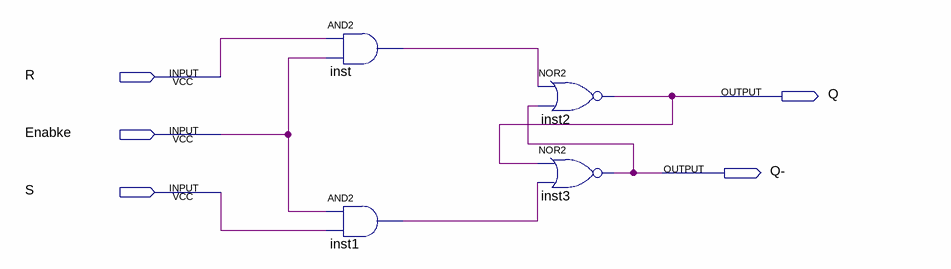
[diagram p0: schematic sheet]
// Quartus schematic Tflip.bdf as structural Verilog: 4 symbols, 5 pins
module Tflip (
  input  R,
  input  Enabke,
  input  S,
  output Q,
  output \Q- 
);

  wire inst1_out, inst_out;

  and inst (inst_out, R, Enabke);
  and inst1 (inst1_out, Enabke, S);
  nor inst2 (Q, inst_out, \Q- );
  nor inst3 (\Q- , Q, inst1_out);
endmodule
